# Altium project eTraceConcrete_V1_1.PrjPcb (part 4 of 7)

## Sheet AnalogInputs.SchDoc
size A3
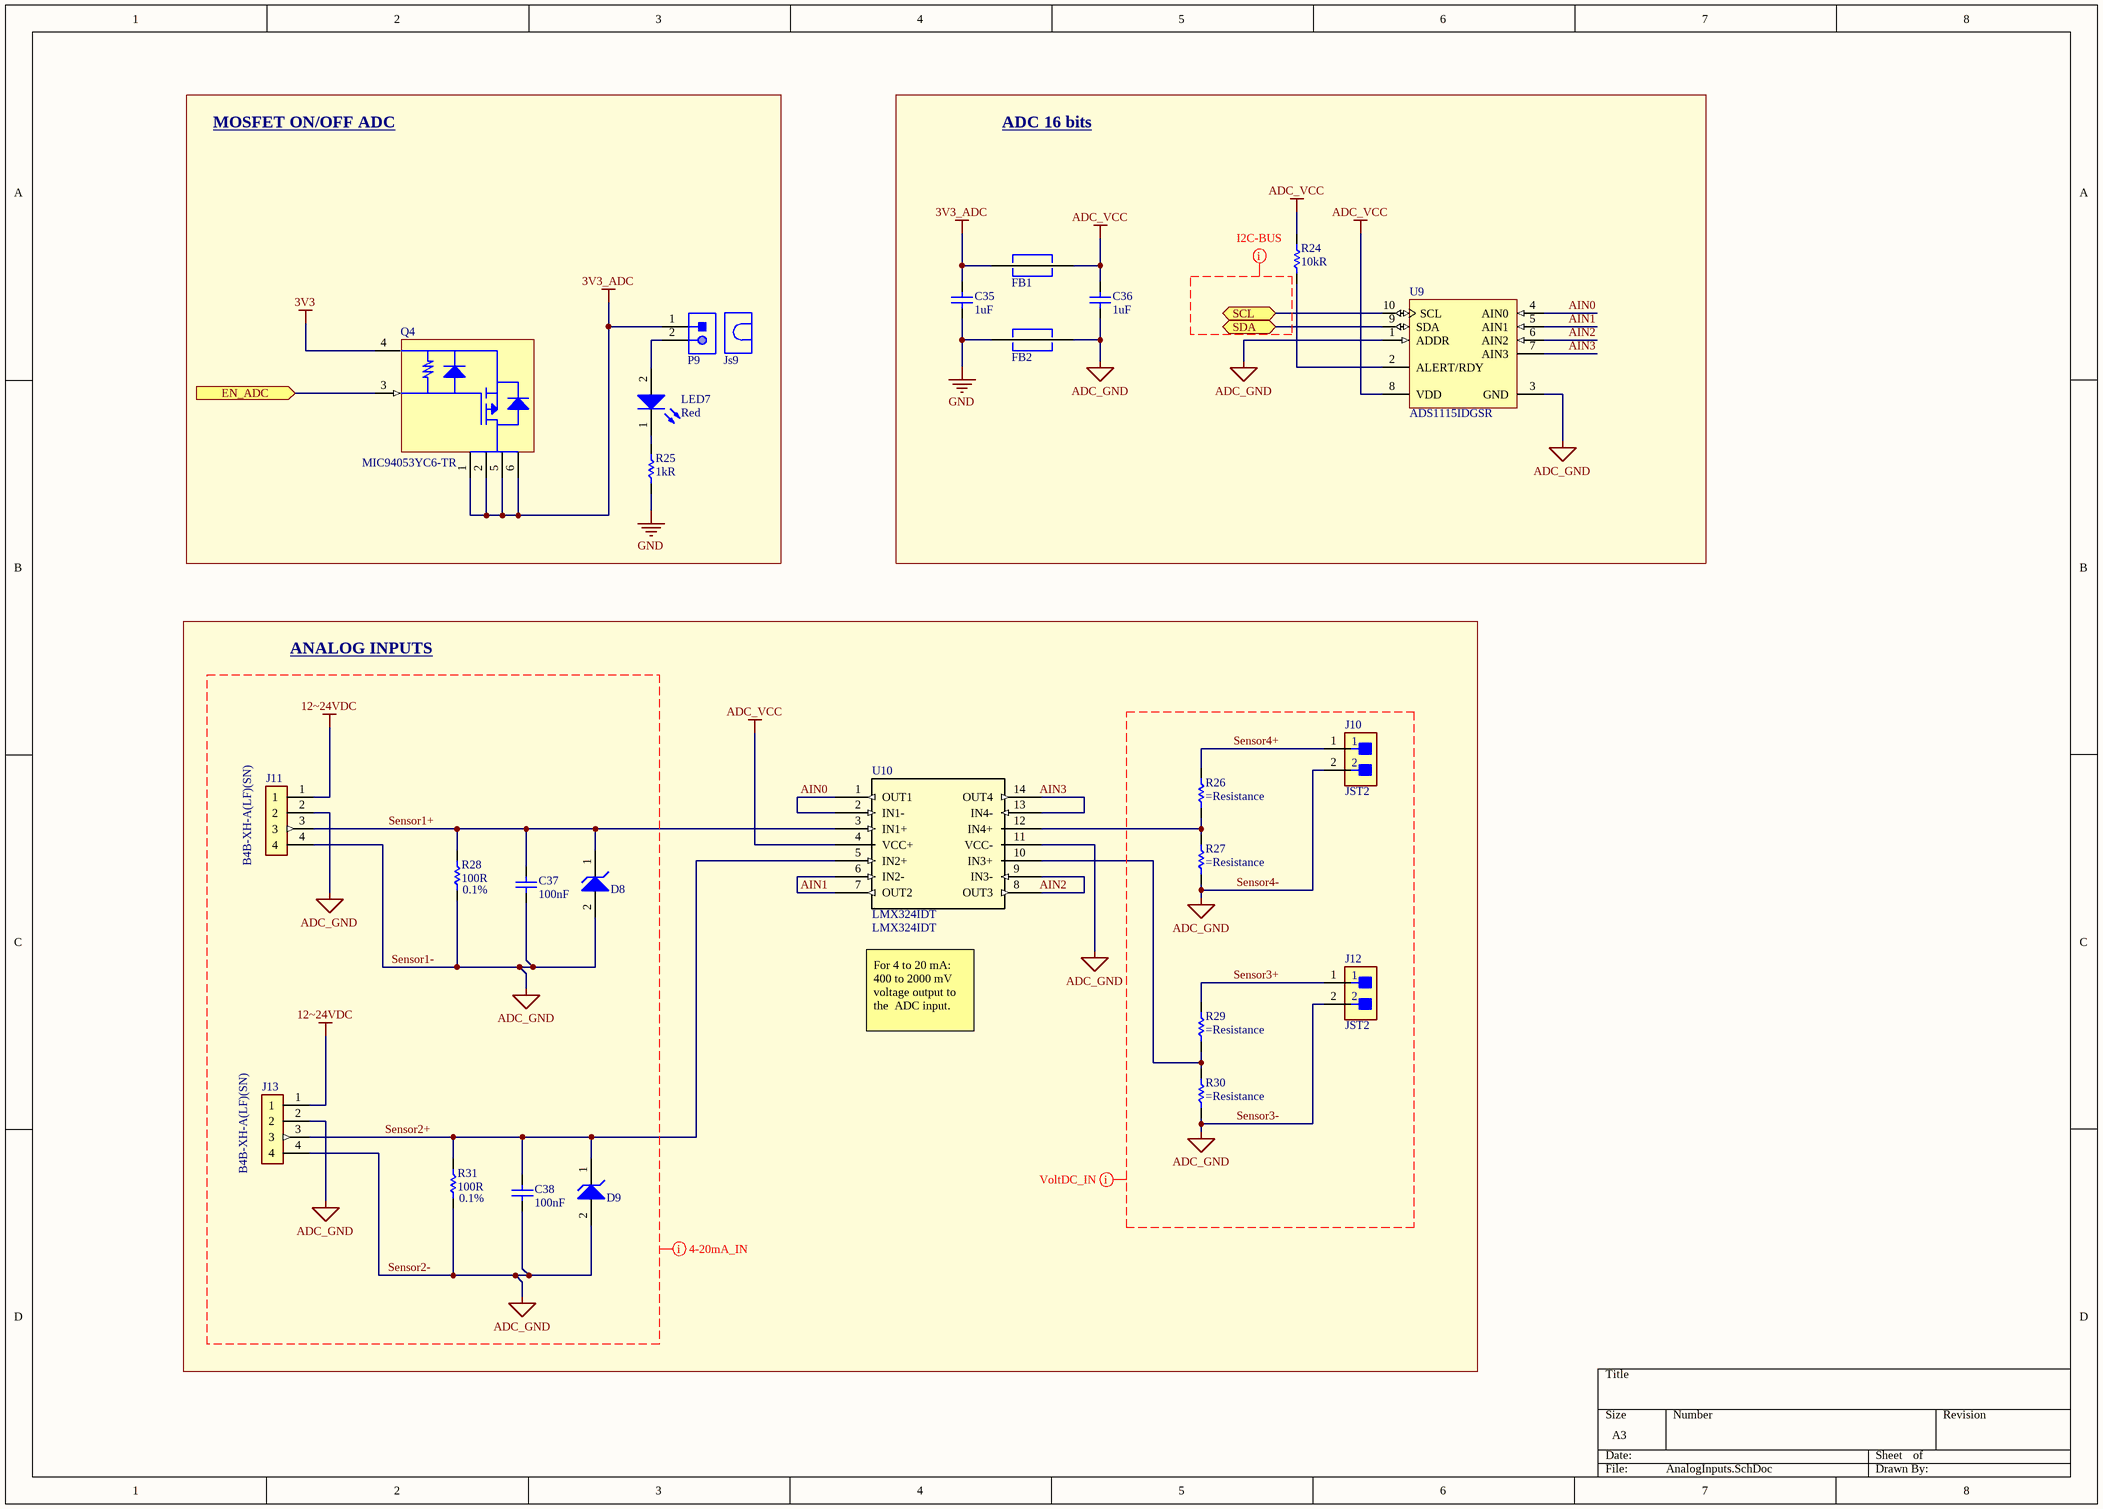
[diagram p4: AnalogInputs.SchDoc]

### Parts
C35  1uF  [Cap 0805 (2012 Metric)]
C36  1uF  [Cap 0805 (2012 Metric)]
C37  100nF  [Cap 0805 (2012 Metric)]
C38  100nF  [Cap 0805 (2012 Metric)]
D8  Diode  [Diode SOD123]  (value not drawn)
D9  Diode  [Diode SOD123]  (value not drawn)
FB1  Ferrite Bead  [Ferrite Bead 0805 (2012 Metric)]  (value not drawn)
FB2  Ferrite Bead  [Ferrite Bead 0805 (2012 Metric)]  (value not drawn)
J10  JST2  [JST2]
J11  B4B-XH-A(LF)(SN)  [B4B-XH-A(LF)(SN)]
J12  JST2  [JST2]
J13  B4B-XH-A(LF)(SN)  [B4B-XH-A(LF)(SN)]
Js9  Jumper (2x1)  [Header JMP 2x1]  (value not drawn)
LED7  Red  [LED 0805(2012 METRIC)]
P9  Header 2x1  [Header 2x1]  (value not drawn)
Q4  MIC94053YC6-TR  [SC-70-6]
R24  10kR  [Res 0805 (2012 Metric)]
R25  1kR  [Res 0805 (2012 Metric)]
R26  (no value)  [Res 0805 (2012 Metric)]
R27  (no value)  [Res 0805 (2012 Metric)]
R28  100R  Tolerance: 0.1%  [Res 1206 (3216 Metric)]
R29  (no value)  [Res 0805 (2012 Metric)]
R30  (no value)  [Res 0805 (2012 Metric)]
R31  100R  Tolerance: 0.1%  [Res 1206 (3216 Metric)]
U9  ADS1115IDGSR  [10-VSSOP]
U10  LMX324IDT  [LMX324IDT]

### Blocks framed on the sheet
MOSFET ON/OFF ADC: Js9 LED7 P9 Q4 R25
ADC 16 bits: C35 C36 FB1 FB2 R24 U9
ANALOG INPUTS: C37 C38 D8 D9 J10-J13 R26-R31 U10

### Ports
EN_ADC (in), SCL (bidir), SDA (bidir)

### Nets
3V3: Q4.4(S)
3V3_ADC: C35.1 FB1.1 P9.1 Q4.1(D) Q4.2(D) Q4.5(D) Q4.6(D)
12~24VDC: J11.1 J13.1
ADC_VCC: C36.1 FB1.2 R24.1 U9.8(VDD) U10.4(VCC+)
GND: C35.2 FB2.2 R25.2  [project net BS]
Sensor1-: C36.2 C37.2 C38.2 D8.2(A) D9.2(A) FB2.1 J10.2 J11.2 J11.4 J12.2 J13.2 J13.4 R27.2 R28.2 R30.2 R31.2 U9.1(ADDR) U9.3(GND) U10.11(VCC-)  [also labelled ADC_GND, Sensor2-, Sensor3-, Sensor4-]
AIN0: U9.4(AIN0) U10.1(OUT1) U10.2(IN1-)
AIN1: U9.5(AIN1) U10.6(IN2-) U10.7(OUT2)
AIN2: U9.6(AIN2) U10.8(OUT3) U10.9(IN3-)
AIN3: U9.7(AIN3) U10.13(IN4-) U10.14(OUT4)
EN_ADC: Q4.3(G) ; port EN_ADC
SCL: U9.10(SCL) ; port SCL
SDA: U9.9(SDA) ; port SDA
Sensor1+: C37.1 D8.1(K) J11.3 R28.1 U10.3(IN1+)
Sensor2+: C38.1 D9.1(K) J13.3 R31.1 U10.5(IN2+)
Sensor3+: J12.1 R29.1
Sensor4+: J10.1 R26.1
NetLED7_1: LED7.1(K) R25.1
NetLED7_2: LED7.2(A) P9.2
NetR24_2: R24.2 U9.2(ALERT/RDY)
NetR26_2: R26.2 R27.1 U10.12(IN4+)
NetR29_2: R29.2 R30.1 U10.10(IN3+)

### Layout directives
net class 4-20mA_IN: 12~24VDC, ADC_GND, Sensor1+, Sensor1-, Sensor2+, Sensor2-
net class VoltDC_IN: ADC_GND, Sensor3+, Sensor3-, Sensor4+, Sensor4-
net class I2C-BUS: (no net found under the mark)

### Notes on the sheet
- For 4 to 20 mA:
  400 to 2000 mV voltage output to the  ADC input.

### Library data of the parts
C35 C36 = Capacitor: Ceramic capacitor SMD-0805 1000nF /16V X7R# K +-10%, Samsung, RoHS/3000pcs/; Manufacturer Part Number: CL21B105KOFNNNG; Voltage Rating: 16V; Tolerance: 10%; Dielectric: X7R; Link: https://www.digikey.com/es/products/detail/samsung-electro-mechanics/CL21B105KOFNNNG/3894469?s=N4IgTCBcDaIMIBkwEYBCyAMBWA0geQDEA5EgcRAF0BfIA; Supplier 1: Digi-Key; Supplier Part Number 1: 1276-6471-1-ND; Manufacturer: Samsung; RoHS: Yes; Category: Ceramic Capacitors; Stock 1: 36000; Pricing 1: 1=0,10000, 10=0,05700, 50=0,03120, 100=0,02540, 500=0,01816, 1000=0,01426 (USD); Mount: Surface Mount; Case/Package: 0805; Case Code (Metric): 2012; Case Code (Imperial): 0805; Material: Ceramic; Min Operating Temperature: -55°C; Max Operating Temperature: 125°C; Package Quantity: 3000; Packaging: Tape and Reel; Capacitance: 1uF; Voltage: 16V; Series: CL; Length: 2mm; Width: 0.049inch; Height: 1.25mm; Thickness: 0.053inch; Depth: 1.25mm; Lead Free: Lead Free; ComponentLink1URL: https://datasheet.ciiva.com/25733/cl21b105kofnnng-25733281.pdf?src-supplier=Digi-Key; ComponentLink1Description: https://datasheet.ciiva.com/25733/cl21b105kofnnng-25733281.pdf?src-supplier=Digi-Key; ComponentLink2URL: https://datasheet.ciiva.com/29199/455935-da-01-en-vs-kondensator-0805-29199047.pdf?src-supplier=Conrad; ComponentLink2Description: https://datasheet.ciiva.com/29199/455935-da-01-en-vs-kondensator-0805-29199047.pdf?src-supplier=Conrad; ComponentLink3URL: https://datasheet.ciiva.com/16428/cl05b104kq5nnnc-16428885.pdf?src-supplier=Future+Electronics; ComponentLink3Description: https://datasheet.ciiva.com/16428/cl05b104kq5nnnc-16428885.pdf?src-supplier=Future+Electronics; ComponentLink4URL: https://datasheet.ciiva.com/26310/mlcc-catalogdownload2013-eng-26310156.pdf?src-supplier=Distrelec; ComponentLink4Description: https://datasheet.ciiva.com/26310/mlcc-catalogdownload2013-eng-26310156.pdf?src-supplier=Distrelec
C37 C38 = Capacitor: YAGEO (PHYCOMP)         CC0805ZRY5V9BB104             SMD Multilayer Ceramic Capacitor, 0805 [2012 Metric], 0.1 uF, 50 V, +80%, -20%, Y5V, CC Series; Tolerance: 80%; Voltage Rating: 50V; Link: https://www.digikey.com/es/products/detail/yageo/CC0805ZRY5V9BB104/2103099?s=N4IgTCBcDaIMJwAwA5EFYBaAlAmmgagJwBCxAjIgCwgC6AvkA; Supplier 1: Digi-Key; Supplier Part Number 1: 311-1361-1-ND; Manufacturer: Yageo; Manufacturer Part Number: CC0805ZRY5V9BB104; RoHS: Yes; Category: Ceramic Capacitors; Stock 1: 92689; Pricing 1: 1=0,10000, 10=0,07000, 50=0,03800, 100=0,03100, 500=0,02214, 1000=0,01739 (USD); Mount: Surface Mount; Case/Package: 0805; Number of Pins: 2; Case Code (Metric): 2012; Case Code (Imperial): 0805; Material: Ceramic; Dielectric Material: Ceramic; Min Operating Temperature: -30°C; Max Operating Temperature: 85°C; Capacitance: 100nF; Dielectric: Y5V; Package Quantity: 1; Packaging: Tape and Reel; Voltage Rating (DC): 50V; Termination: SMD/SMT; Resistor Type: Ceramic; Series: CC; Construction: Flat; Length: 2mm; Width: 0.049inch; Height: 0.6mm; Depth: 1.25mm; Thickness: 0.024inch; Radiation Hardening: No; REACH SVHC: No SVHC; Lead Free: Lead Free; Halogen Free: Halogen Free; RoHS Compliant: Yes; ComponentLink1URL: https://datasheet.ciiva.com/144/mlccorderingcode-144209.pdf?src-supplier=Digi-Key; ComponentLink1Description: https://datasheet.ciiva.com/144/mlccorderingcode-144209.pdf?src-supplier=Digi-Key; ComponentLink2URL: https://datasheet.ciiva.com/144/mlccorderingcode-144210.pdf?src-supplier=Digi-Key; ComponentLink2Description: https://datasheet.ciiva.com/144/mlccorderingcode-144210.pdf?src-supplier=Digi-Key; ComponentLink3URL: https://datasheet.ciiva.com/144/mlccorderingcode-144211.pdf?src-supplier=Digi-Key; ComponentLink3Description: https://datasheet.ciiva.com/144/mlccorderingcode-144211.pdf?src-supplier=Digi-Key; ComponentLink4URL: https://datasheet.ciiva.com/11465/upy-gphc-y5v-6-3v-to-50v-5-11465865.pdf?src-supplier=Avnet; ComponentLink4Description: https://datasheet.ciiva.com/11465/upy-gphc-y5v-6-3v-to-50v-5-11465865.pdf?src-supplier=Avnet; ComponentLink5URL: https://datasheet.ciiva.com/13389/upy-gp-np0-16v-to-50v-8-13389351.pdf?src-supplier=Mouser; ComponentLink5Description: https://datasheet.ciiva.com/13389/upy-gp-np0-16v-to-50v-8-13389351.pdf?src-supplier=Mouser; ComponentLink6URL: https://datasheet.ciiva.com/17435/upy-gphc-y5v-6-3v-to-50v-5-17435053.pdf?src-supplier=Avnet+Europe; ComponentLink6Description: https://datasheet.ciiva.com/17435/upy-gphc-y5v-6-3v-to-50v-5-17435053.pdf?src-supplier=Avnet+Europe; ComponentLink7URL: https://datasheet.ciiva.com/15189/getdatasheetpartid-55882-15189238.pdf?src-supplier=Verical; ComponentLink7Description: https://datasheet.ciiva.com/15189/getdatasheetpartid-55882-15189238.pdf?src-supplier=Verical; ComponentLink8URL: https://datasheet.ciiva.com/16747/upy-gphc-y5v-6-3v-to-50v-5-revised-16747323.pdf?src-supplier=Future+Electronics; ComponentLink8Description: https://datasheet.ciiva.com/16747/upy-gphc-y5v-6-3v-to-50v-5-revised-16747323.pdf?src-supplier=Future+Electronics; ComponentLink9URL: https://datasheet.ciiva.com/28450/1132289-28450870.pdf?src-supplier=Element14; ComponentLink9Description: https://datasheet.ciiva.com/28450/1132289-28450870.pdf?src-supplier=Element14; ComponentLink10URL: https://datasheet.ciiva.com/29241/445331-da-01-en-kerko-chip-0805-y5v0-1uf-20-80proz50vg-29241946.pdf?src-supplier=Conrad; ComponentLink10Description: https://datasheet.ciiva.com/29241/445331-da-01-en-kerko-chip-0805-y5v0-1uf-20-80proz50vg-29241946.pdf?src-supplier=Conrad
D8 D9 = Diode: DIODE GEN PURP 75V 150MA 0603; Manufacturer: Taiwan Semiconductor; Manufacturer Part Number: TS4148CRZG; Forward Voltage: 1.25V; Peak Non-Repetitive Surge Current: 800mA; Element Configuration: Single; Max Forward Surge Current (Ifsm): 2A; Reverse Recovery Time: 4ns; Link: https://www.digikey.com/es/products/detail/taiwan-semiconductor-corporation/TS4148C-RZG/7359811?s=N4IgTCBcDaICoGUAsBGJAOAwgJQFoHEQBdAXyA; Supplier 1: Digi-Key; Supplier Part Number 1: TS4148CRZGCT-ND; RoHS: Yes; Category: Uncategorized; Stock 1: 278970; Pricing 1: 1=0,39000, 10=0,29400, 100=0,16640, 500=0,11022, 1000=0,08450, 2000=0,07348 (USD); Mount: Surface Mount; Case/Package: SMD/SMT; Number of Pins: 2; Min Operating Temperature: -55°C; Max Operating Temperature: 150°C; Packaging: Tape and Reel; Package Quantity: 5000; Max Repetitive Reverse Voltage (Vrrm): 75V; Radiation Hardening: No; RoHS Compliant: Yes; ComponentLink1URL: https://datasheet.ciiva.com/18168/getdatasheetpartid-464901-18168310.pdf?src-supplier=Verical; ComponentLink1Description: https://datasheet.ciiva.com/18168/getdatasheetpartid-464901-18168310.pdf?src-supplier=Verical
FB1 FB2 = Ferrite Bead: 1 kOhms @ 100MHz 1 Power Line Ferrite Bead 0805 (2012 Metric) 1.5A 150mOhm; Manufacturer: TDK; Manufacturer Part Number: MPZ2012S102AT000; Tolerance: 25%; Impedance: 1kR; DC Resistance (DCR): 150mR; Link: https://www.digikey.com/product-detail/en/tdk-corporation/MPZ2012S102AT000/445-5223-1-ND/2117957; Supplier 1: Digi-Key; Supplier Part Number 1: 445-5223-1-ND; RoHS: Yes; Category: Inductors; Stock 1: 277470; Pricing 1: 1=0,11000, 10=0,09100, 25=0,07040, 50=0,05840, 100=0,05030, 250=0,04028, 500=0,03624, 1000=0,03020 (USD); Mount: Surface Mount; Case/Package: 0805; Weight: 0.000194oz; Case Code (Metric): 2012; Case Code (Imperial): 0805; Core Material: Ferrite; Min Operating Temperature: -55°C; Max Operating Temperature: 125°C; Termination: SMD/SMT; Test Frequency: 100MHz; Package Quantity: 4000; Packaging: Tape and Reel; Max DC Current: 1.5A; Current Rating: 1.5A; Length: 0.079inch; Height: 0.85mm; Width: 1.25mm; Depth: 1.25mm; REACH SVHC: No SVHC; ComponentLink1URL: https://datasheet.ciiva.com/46634/beads-commercial-power-mpz-en-46634422.pdf?src-supplier=Digi-Key; ComponentLink1Description: https://datasheet.ciiva.com/46634/beads-commercial-power-mpz-en-46634422.pdf?src-supplier=Digi-Key; ComponentLink2URL: https://datasheet.ciiva.com/46634/beads-commercial-power-mpz-en-46634424.pdf?src-supplier=Digi-Key; ComponentLink2Description: https://datasheet.ciiva.com/46634/beads-commercial-power-mpz-en-46634424.pdf?src-supplier=Digi-Key; ComponentLink3URL: https://datasheet.ciiva.com/48682/beads-commercial-power-mpz-en-48682506.pdf?src-supplier=Avnet; ComponentLink3Description: https://datasheet.ciiva.com/48682/beads-commercial-power-mpz-en-48682506.pdf?src-supplier=Avnet; ComponentLink4URL: https://datasheet.ciiva.com/46381/1856146-46381611.pdf?src-supplier=Element14; ComponentLink4Description: https://datasheet.ciiva.com/46381/1856146-46381611.pdf?src-supplier=Element14; ComponentLink5URL: https://datasheet.ciiva.com/46634/beads-commercial-power-mpz-en-46634366.pdf?src-supplier=Digi-Key; ComponentLink5Description: https://datasheet.ciiva.com/46634/beads-commercial-power-mpz-en-46634366.pdf?src-supplier=Digi-Key
J10 J12 = JST2: Conn Shrouded Header (4 Sides) HDR 2 POS 2.5mm Solder ST Thru-Hole Box; Manufacturer: JST; Manufacturer Part Number: B2B-XH-A(LF)(SN); Number of Positions: 2; Connector Type: Male Pin; Contact Resistance: 20mR; Max Current Rating: 3A; Max Voltage Rating (AC): 250V; Insulation Resistance: 1GR; Wire/Cable Gauge: 22AWG; Supplier 1: Farnell; RoHS: Yes; Category: FFC / FPC; Stock 1: 212689; Mount: Through Hole; Contact Plating: Tin,Copper,Lead; Color: Natural; Contact Material: Brass; Housing Material: Polyamide; Housing Color: White; Min Operating Temperature: -25°C; Max Operating Temperature: 85°C; Termination: Solder; Number of Rows: 1; Packaging: Bulk; Series: XH; Contact Type: Male Pin; Fastening Type: Detent; Orientation: Straight; Current Rating: 3A; Voltage Rating: 250V; Voltage Rating (AC): 250V; Number of Contacts: 2; Max Voltage Rating (DC): 250V; Length: 7.4mm; Pitch: 2.5mm; Depth: 5.75mm; Lead Pitch: 2.5mm; Lead Free: Lead Free; REACH SVHC: No SVHC; ComponentLink1URL: https://datasheet.ciiva.com/26894/getdatasheetpartid-640357-26894434.pdf?src-supplier=Verical; ComponentLink1Description: https://datasheet.ciiva.com/26894/getdatasheetpartid-640357-26894434.pdf?src-supplier=Verical; ComponentLink2URL: https://datasheet.ciiva.com/26894/getdatasheetpartid-385291-26894760.pdf?src-supplier=Verical; ComponentLink2Description: https://datasheet.ciiva.com/26894/getdatasheetpartid-385291-26894760.pdf?src-supplier=Verical; ComponentLink3URL: https://datasheet.ciiva.com/11746/0900766b8082653e-11746979.pdf?src-supplier=RSComponents; ComponentLink3Description: https://datasheet.ciiva.com/11746/0900766b8082653e-11746979.pdf?src-supplier=RSComponents; ComponentLink4URL: https://datasheet.ciiva.com/20207/523653-20207167.pdf?src-supplier=Rapid+Electronics; ComponentLink4Description: https://datasheet.ciiva.com/20207/523653-20207167.pdf?src-supplier=Rapid+Electronics; ComponentLink5URL: https://datasheet.ciiva.com/8052/5448-8052024.pdf?src-supplier=Element14; ComponentLink5Description: https://datasheet.ciiva.com/8052/5448-8052024.pdf?src-supplier=Element14; Supplier Part Number 1: 1516276; Pricing 1: 100=0,06860, 1000=0,04800, 2500=0,04520, 5000=0,04230, 10000=0,03950, 20000=0,03660 (GBP); Link: https://www.digikey.com/es/products/detail/jst-sales-america-inc/B2B-XH-A-LF-SN/1651045?s=N4IgTCBcDaIEJjgWgBoAkkEEAUAZAYgJTYDKAcoSALoC%2BQA
J11 J13 = B4B-XH-A(LF)(SN): JST (JAPAN SOLDERLESS TERMINALS) - B4B-XH-A (LF)(SN) - Wire-To-Board Connector, Vertical, 2.5 mm, 4 Contacts, Header, XH Series, Through Hole, 1 Rows; Insulation Resistance: 1GR; Current Rating: 3A; Contact Resistance: 20mR; Gender: Male; Number of Positions: 4; Max Voltage Rating (AC): 250V; Connector Type: Male Pin; Pitch: 2.5mm; Wire/Cable Gauge: 22AWG; Supplier 1: Arrow Electronics; Manufacturer: JST; RoHS: Yes; Category: FFC / FPC; Mount: Through Hole; Contact Plating: Tin,Copper,Lead; Contact Material: Brass; Color: Natural; Housing Material: Polyamide; Housing Color: White; Material: Polyamide; Min Operating Temperature: -25°C; Max Operating Temperature: 85°C; Termination: Press-Fit; Series: XH; Number of Rows: 1; Packaging: Bulk; Orientation: Straight; Max Current Rating: 3A; Package Quantity: 500; Number of Contacts: 4; Contact Type: Male Pin; Voltage Rating (AC): 250V; Voltage Rating: 250V; Max Voltage Rating (DC): 250V; Length: 12.4mm; Depth: 5.75mm; Lead Pitch: 2.5mm; REACH SVHC: No SVHC; Lead Free: Lead Free; ComponentLink1URL: https://datasheet.ciiva.com/26894/getdatasheetpartid-455616-26894787.pdf?src-supplier=Verical; ComponentLink1Description: https://datasheet.ciiva.com/26894/getdatasheetpartid-455616-26894787.pdf?src-supplier=Verical; ComponentLink2URL: https://datasheet.ciiva.com/16203/b4b-xh-alfsn-16203642.pdf?src-supplier=Future+Electronics; ComponentLink2Description: https://datasheet.ciiva.com/16203/b4b-xh-alfsn-16203642.pdf?src-supplier=Future+Electronics; ComponentLink3URL: https://datasheet.ciiva.com/26924/getdatasheetpartid-640571-26924035.pdf?src-supplier=Verical; ComponentLink3Description: https://datasheet.ciiva.com/26924/getdatasheetpartid-640571-26924035.pdf?src-supplier=Verical; ComponentLink4URL: https://datasheet.ciiva.com/726/exh-726404.pdf?src-supplier=Digi-Key; ComponentLink4Description: https://datasheet.ciiva.com/726/exh-726404.pdf?src-supplier=Digi-Key; Manufacturer Part Number: B4B-XH-A(LF)(SN); Supplier Part Number 1: B4B-XH-A (LF)(SN); Link: https://www.digikey.com/es/products/detail/jst-sales-america-inc/B4B-XH-A-LF-SN/1651047?s=N4IgTCBcDaIEIBY4FoAaAJZBBAFAGQDEBKHAZQDkiQBdAXyA
Js9 = Jumper (2x1): 2 (1 x 2) Position Shunt Connector Black Open Top 0.100" (2.54mm) Gold; Manufacturer: Sullins; Manufacturer Part Number: QPC02SXGN-RC; Number of Positions: 2; Pitch: 0.1inch; Link: https://www.digikey.com/product-detail/en/sullins-connector-solutions/QPC02SXGN-RC/S9337-ND/2618262; Supplier 1: Digi-Key; Supplier Part Number 1: S9337-ND; RoHS: Yes; Category: Connectors; Stock 1: 529611; Pricing 1: 1=0,10000, 10=0,05900, 25=0,04400, 50=0,03780, 100=0,03650, 250=0,03152, 500=0,03024, 1000=0,02646, 2500=0,02394 (USD); Case/Package: 100; Contact Plating: Gold; Package Quantity: 2000; Packaging: Bulk; Height: 0.235inch; Lead Free: Lead Free; ComponentLink1URL: https://datasheet.ciiva.com/767/284-sxgn-11510-767869.pdf?src-supplier=Digi-Key; ComponentLink1Description: https://datasheet.ciiva.com/767/284-sxgn-11510-767869.pdf?src-supplier=Digi-Key
LED7 = LED: SMD LED red 2.4 V 0805, 150080RS75000, Würth Elektronik; Manufacturer: Wurth Electronics; Luminous Intensity: 150mcd; Viewing Angle: 140°; Forward Voltage: 2V; Wavelength: 625nm; Lens Style: Clear,Rectangular; Forward Current: 30mA; Test Current: 20mA; Link: https://www.digikey.com/es/products/detail/w%C3%BCrth-elektronik/150080RS75000/4489918?s=N4IgTCBcDaIIwFYAMSAcSBKBlA7MlIAugL5A; Supplier 1: Digi-Key; Supplier Part Number 1: 732-4984-1-ND; Manufacturer Part Number: 150080RS75000; RoHS: Yes; Category: LEDs; Stock 1: 57843; Pricing 1: 1=0,18000, 50=0,16500, 100=0,14200, 500=0,12300 (USD); Mount: Surface Mount; Case/Package: 0805; Color: Red; Case Code (Metric): 2012; Case Code (Imperial): 0805; Min Operating Temperature: -40°C; Max Operating Temperature: 85°C; Package Quantity: 4000; Packaging: Tape and Reel; Dominant Wavelength: 625nm; Length: 2mm; Width: 1.25mm; Height: 0.7mm; REACH SVHC: Unknown; RoHS Compliant: Yes; ComponentLink1URL: https://datasheet.ciiva.com/22656/150080rs75000-22656961.pdf?src-supplier=Element14; ComponentLink1Description: https://datasheet.ciiva.com/22656/150080rs75000-22656961.pdf?src-supplier=Element14; ComponentLink2URL: https://datasheet.ciiva.com/29279/759435-da-01-en-chipled-0805-w-kl-rot-150080rs75000-29279032.pdf?src-supplier=Conrad; ComponentLink2Description: https://datasheet.ciiva.com/29279/759435-da-01-en-chipled-0805-w-kl-rot-150080rs75000-29279032.pdf?src-supplier=Conrad
P9 = Header 2x1: Connector Header Through Hole 2 position 0.100" (2.54mm); Manufacturer: Amphenol FCI; Manufacturer Part Number: 68001-402HLF; Number of Contacts: 2; Connector Type: Male Pin; Insulation Resistance: 5GR; Max Voltage Rating (AC): 1.5kV; Gender: Male; Current Rating: 3A; Contact Post Length: 3.05mm; Link: https://www.digikey.com/product-detail/en/amphenol-icc-fci/68001-402HLF/609-3507-ND/1530472; Supplier 1: Digi-Key; Supplier Part Number 1: 609-3507-ND; RoHS: Yes; Category: Headers and Wire Housings; Stock 1: 5598; Pricing 1: 1=0,12000, 10=0,11600, 100=0,07160, 500=0,05928, 1000=0,05187, 5000=0,04446, 10000=0,04323 (USD); Mount: Through Hole; Contact Plating: Tin; Housing Material: Thermoplastic; Housing Color: Black; Color: Black; Contact Material: Bronze; Min Operating Temperature: -65°C; Max Operating Temperature: 125°C; Termination: Solder; Number of Rows: 1; Number of Positions: 2; Orientation: Straight; Package Quantity: 100; Packaging: Bulk; Contact Gender: Male; Voltage Rating: 1.5kV; Length: 5.08mm; Pitch: 2.54mm; Contact Mating Length: 0.23inch; Depth: 2.41mm; Radiation Hardening: No; REACH SVHC: No SVHC; Flammability Rating: UL94 V-0; Lead Free: Lead Free; ComponentLink1URL: https://datasheet.ciiva.com/724/68000-724389.pdf?src-supplier=Digi-Key; ComponentLink1Description: https://datasheet.ciiva.com/724/68000-724389.pdf?src-supplier=Digi-Key; ComponentLink2URL: https://datasheet.ciiva.com/16726/68000-16726185.pdf?src-supplier=Avnet+Europe; ComponentLink2Description: https://datasheet.ciiva.com/16726/68000-16726185.pdf?src-supplier=Avnet+Europe; ComponentLink3URL: https://datasheet.ciiva.com/10149/68000-10149338.pdf?src-supplier=Avnet; ComponentLink3Description: https://datasheet.ciiva.com/10149/68000-10149338.pdf?src-supplier=Avnet; ComponentLink4URL: https://datasheet.ciiva.com/46385/1748756-46385306.pdf?src-supplier=Element14; ComponentLink4Description: https://datasheet.ciiva.com/46385/1748756-46385306.pdf?src-supplier=Element14
Q4 = TransistorMosfet(Load): P-Channel 6V 2A (Ta) 270mW (Ta) Surface Mount SC-70-6; Manufacturer: Microchip; Link: https://www.digikey.com/product-detail/en/microchip-technology/MIC94053YC6-TR/576-2939-1-ND/1822099; Supplier 1: Digi-Key; Supplier Part Number 1: 576-2939-1-ND; Manufacturer Part Number: MIC94053YC6-TR; RoHS: Yes; Category: MOSFETs; Stock 1: 3005; Pricing 1: 1=0,58000, 25=0,48000, 100=0,46250 (USD); ComponentLink1URL: https://datasheet.ciiva.com/6379/mic94052-53-6379193.pdf?src-supplier=Digi-Key; ComponentLink1Description: https://datasheet.ciiva.com/6379/mic94052-53-6379193.pdf?src-supplier=Digi-Key; ComponentLink2URL: https://datasheet.ciiva.com/6379/mic94052-53-6379189.pdf?src-supplier=Digi-Key; ComponentLink2Description: https://datasheet.ciiva.com/6379/mic94052-53-6379189.pdf?src-supplier=Digi-Key; ComponentLink3URL: https://datasheet.ciiva.com/46408/264781-46408581.pdf?src-supplier=Element14; ComponentLink3Description: https://datasheet.ciiva.com/46408/264781-46408581.pdf?src-supplier=Element14; ComponentLink4URL: https://datasheet.ciiva.com/15200/getdatasheetpartid-111629-15200795.pdf?src-supplier=Verical; ComponentLink4Description: https://datasheet.ciiva.com/15200/getdatasheetpartid-111629-15200795.pdf?src-supplier=Verical
R24 = Resistor: RES 10K OHM 1% 1/4W 0805; Manufacturer: Stackpole Electronics; Manufacturer Part Number: RNCP0805FTD10K0; Max Power Dissipation: 250mW; Temperature Coefficient: 100ppm/°C; Link: https://www.digikey.com/en/products/detail/stackpole-electronics-inc/RNCP0805FTD10K0/2240262; Supplier 1: Digi-Key; Supplier Part Number 1: RNCP0805FTD10K0CT-ND; RoHS: Yes; Category: Chip SMD Resistors; Stock 1: 271706; Pricing 1: 1=0,10000, 10=0,07300, 100=0,02970, 1000=0,01336, 2500=0,01159 (USD); Mount: Surface Mount; Case/Package: 0805; Case Code (Metric): 2012; Case Code (Imperial): 0805; Min Operating Temperature: -55°C; Max Operating Temperature: 155°C; Resistance: 10kR; Tolerance: 1%; Packaging: Tape and Reel; Resistor Type: Thin Film; Number of Terminations: 2; Features: Moisture Resistant,Anti-Sulfur; Series: RNCP; Length: 0.079inch; Width: 0.049inch; Height: 0.024inch; Lead Free: Lead Free; RoHS Compliant: Yes; ComponentLink1URL: https://www.seielect.com/catalog/SEI-Packaging.pdf?src-supplier=Digi-Key; ComponentLink1Description: https://www.seielect.com/catalog/SEI-Packaging.pdf?src-supplier=Digi-Key
R25 = Resistor: RES 1K OHM 1% 1/4W 0805; Manufacturer: Stackpole Electronics; Manufacturer Part Number: RNCP0805FTD1K00; Power Rating: 250mW; Temperature Coefficient: 100ppm/°C; Link: https://www.digikey.com/es/products/detail/stackpole-electronics-inc/RNCP0805FTD1K00/2240229?s=N4IgTCBcDaIEoDkDCAFADADjQVgGIBUARARgGk00QBdAXyA; Supplier 1: Digi-Key; Supplier Part Number 1: RNCP0805FTD1K00CT-ND; RoHS: Yes; Category: Chip SMD Resistors; Stock 1: 316834; Pricing 1: 1=0,10000, 10=0,07000, 100=0,02830, 1000=0,01272, 2500=0,01104 (USD); Mount: Surface Mount; Case/Package: 0805; Case Code (Metric): 2012; Case Code (Imperial): 0805; Size Code: 0805; Min Operating Temperature: -55°C; Max Operating Temperature: 155°C; Tolerance: 1%; Resistance: 1kR; Packaging: Tape and Reel; Resistor Type: Thin Film; Number of Terminations: 2; Max Power Dissipation: 250mW; Features: Moisture Resistant,Anti-Sulfur; Series: RNCP; Length: 0.079inch; Width: 0.049inch; Height: 0.024inch; Lead Free: Lead Free; RoHS Compliant: Yes; ComponentLink1URL: https://www.seielect.com/catalog/SEI-Packaging.pdf?src-supplier=Digi-Key; ComponentLink1Description: https://www.seielect.com/catalog/SEI-Packaging.pdf?src-supplier=Digi-Key; ComponentLink2URL: https://www.seielect.com/Catalog/SEI-rncp.pdf?src-supplier=Digi-Key; ComponentLink2Description: https://www.seielect.com/Catalog/SEI-rncp.pdf?src-supplier=Digi-Key; ComponentLink3URL: http://www.seielect.com/Catalog/SEI-rncp.pdf?src-supplier=Future+Electronics; ComponentLink3Description: http://www.seielect.com/Catalog/SEI-rncp.pdf?src-supplier=Future+Electronics
R26 R27 R29 R30 = Resistor
R28 R31 = Resistor: RES 100 OHM 0.40W 0.1% 1206; Manufacturer: Vishay Dale Thin Film; Manufacturer Part Number: PTN1206E1000BST1; Max Power Dissipation: 400mW; Temperature Coefficient: 25ppm/°C; Operating Supply Voltage: 200V; Link: https://www.digikey.com/es/products/detail/vishay-dale-thin-film/PTN1206E1000BST1/2281890; Supplier 1: Digi-Key; Supplier Part Number 1: 764-1205-1-ND; RoHS: Yes; Category: Chip SMD Resistors; Stock 1: 3315; Pricing 1: 1=0,80000, 10=0,69300, 100=0,48300 (USD); Case/Package: 1206; Case Code (Metric): 3216; Case Code (Imperial): 1206; Contact Plating: Copper,Tin,Silver; Min Operating Temperature: -55°C; Max Operating Temperature: 155°C; Packaging: Tape and Reel; Resistance: 100R; Resistor Type: Thin Film; Number of Terminations: 2; Features: Moisture Resistant,Anti-Sulfur; Series: PTN; Length: 0.126inch; Width: 0.063inch; Height: 0.033inch; Radiation Hardening: No; Lead Free: Lead Free; RoHS Compliant: Yes; ComponentLink1URL: https://datasheet.ciiva.com/8981/ptn-8981095.pdf?src-supplier=Avnet; ComponentLink1Description: https://datasheet.ciiva.com/8981/ptn-8981095.pdf?src-supplier=Avnet
U9 = ADS1115IDGSR: TEXAS INSTRUMENTS - ADS1115IDGSR - ADC, 16BIT, 860SPS, I2C, VSSOP-10; Number of Inputs: 4; Max Supply Voltage (DC): 5.5V; Min Supply Voltage (DC): 2V; Integral Nonlinearity (INL): 1LSB; Supply Type: Single; Conversion Rate: 0.86KS/s; Number of Bits: 16; Sampling Rate: 860S/s; Number of A/D Converters: 1; Resolution: 16b; Polarity: Bipolar; Power Dissipation: 900uW; Link: https://www.digikey.com/product-detail/en/texas-instruments/ADS1115IDGSR/296-38849-1-ND/5142969; Supplier 1: Digi-Key; Supplier Part Number 1: 296-38849-1-ND; Manufacturer: Texas Instruments; Manufacturer Part Number: ADS1115IDGSR; RoHS: Yes; Category: Analog to Digital Converters (ADCs); Stock 1: 18300; Pricing 1: 1=5,36000, 10=4,81700, 25=4,55400, 100=3,74440, 250=3,35984, 500=3,23840, 1000=2,69192 (USD); Case/Package: VSSOP; Number of Pins: 10; Contact Plating: Gold; Min Operating Temperature: -40°C; Max Operating Temperature: 125°C; Interface: I2C; Number of Converters: 1; Min Supply Voltage: 2V; Max Supply Voltage: 5.5V; Package Quantity: 2500; Packaging: Tape and Reel; Radiation Hardening: No; Lead Free: Lead Free; REACH SVHC: No SVHC; ComponentLink1URL: https://datasheet.ciiva.com/4031/47725463s8438921n7713-4031028.pdf?src-supplier=Arrow; ComponentLink1Description: https://datasheet.ciiva.com/4031/47725463s8438921n7713-4031028.pdf?src-supplier=Arrow; ComponentLink2URL: https://datasheet.ciiva.com/25993/sbas444b-25993205.pdf?src-supplier=Avnet+Europe; ComponentLink2Description: https://datasheet.ciiva.com/25993/sbas444b-25993205.pdf?src-supplier=Avnet+Europe; ComponentLink3URL: https://datasheet.ciiva.com/1304/ads1113-1304266.pdf?src-supplier=Digi-Key; ComponentLink3Description: https://datasheet.ciiva.com/1304/ads1113-1304266.pdf?src-supplier=Digi-Key
U10 = LMX324IDT: OP Amp Quad GP R-R O/P 5.5V 14-Pin SOIC T/R; Manufacturer: STMicroelectronics; Common Mode Rejection Ratio: 72dB; Min Supply Voltage: 2.3V; Voltage Gain: 110dB; Gain Bandwidth Product: 1.3MHz; Slew Rate: 0.7V/µs; Number of Channels: 4; Output Current: 26mA; Nominal Supply Current: 180uA; Input Bias Current: 27nA; Input Offset Voltage (Vos): 4mV; Operating Supply Current: 130uA; Output Current per Channel: 70mA; Amplifier Type: GENERAL PURPOSE; Supplier 1: Digi-Key; RoHS: Yes; Category: Amplifiers - Op Amps, Buffer, Instrumentation; Stock 1: 1878; Mount: Surface Mount; Case/Package: SOIC; Number of Pins: 14; Min Operating Temperature: -40°C; Max Operating Temperature: 125°C; Max Supply Voltage: 5.5V; Unity Gain Bandwidth Product: 1.3MHz; Packaging: Tape and Reel; Package Quantity: 2500; Number of Circuits: 4; Number of Elements: 4; Series: -; Supply Current: 180uA; Input Offset Voltage-Max: 4mV; Slew Rate-Nom: 0.7V/µs; Radiation Hardening: No; Lead Free: Lead Free; ComponentLink1URL: https://datasheet.ciiva.com/16219/dm00050849-16219587.pdf?src-supplier=Future+Electronics; ComponentLink1Description: https://datasheet.ciiva.com/16219/dm00050849-16219587.pdf?src-supplier=Future+Electronics; ComponentLink2URL: https://datasheet.ciiva.com/2966/dm00050849-2966046.pdf?src-supplier=Avnet; ComponentLink2Description: https://datasheet.ciiva.com/2966/dm00050849-2966046.pdf?src-supplier=Avnet; Pricing 1: 1=1,26000, 10=1,12900, 25=1,07160, 100=0,88010, 250=0,82272, 500=0,72706, 1000=0,63175 (USD); Supplier Part Number 1: 497-13021-1-ND; Link: https://www.digikey.com/en/products/detail/LMX324IDT/497-13021-1-ND/3306194?itemSeq=375639467; Manufacturer Part Number: LMX324IDT

## Sheet thermocouple.SchDoc
size A3
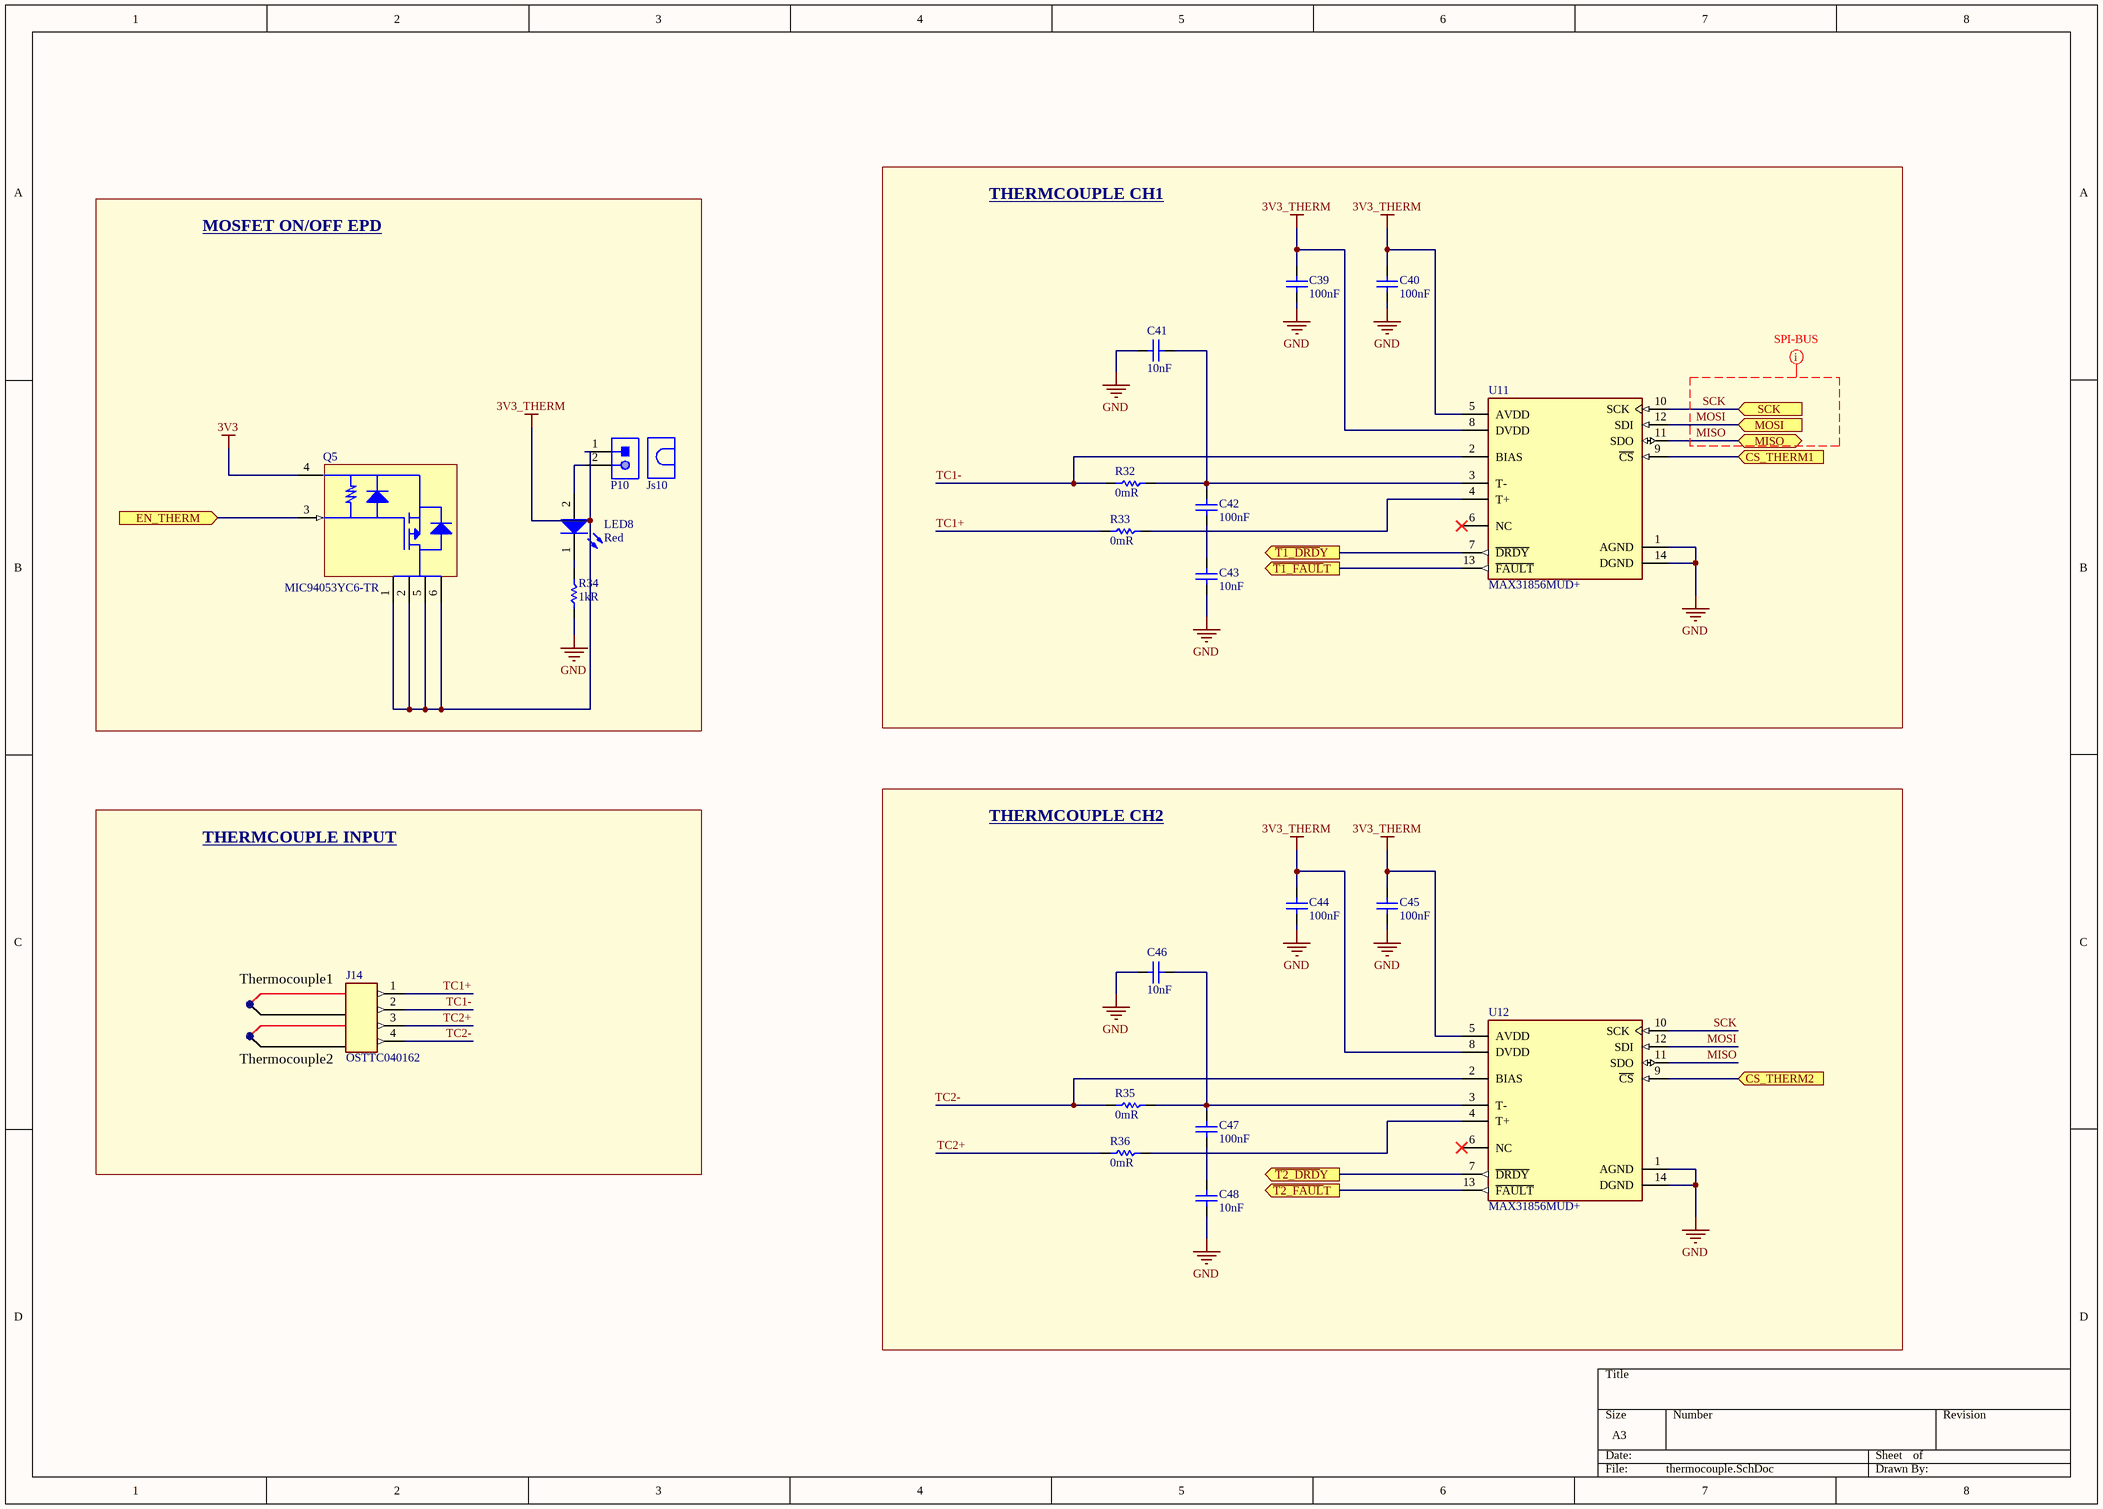
[diagram p5: thermocouple.SchDoc]

### Parts
C39  100nF  [Cap 0805 (2012 Metric)]
C40  100nF  [Cap 0805 (2012 Metric)]
C41  10nF  [Cap 0603 (1608 Metric)]
C42  100nF  [Cap 0805 (2012 Metric)]
C43  10nF  [Cap 0603 (1608 Metric)]
C44  100nF  [Cap 0805 (2012 Metric)]
C45  100nF  [Cap 0805 (2012 Metric)]
C46  10nF  [Cap 0603 (1608 Metric)]
C47  100nF  [Cap 0805 (2012 Metric)]
C48  10nF  [Cap 0603 (1608 Metric)]
J14  OSTTC040162  [OSTTC040162]
Js10  Jumper (2x1)  [Header JMP 2x1]  (value not drawn)
LED8  Red  [LED 0805(2012 METRIC)]
P10  Header 2x1  [Header 2x1]  (value not drawn)
Q5  MIC94053YC6-TR  [SC-70-6]
R32  0mR  [Res 0805 (2012 Metric)]
R33  0mR  [Res 0805 (2012 Metric)]
R34  1kR  [Res 0805 (2012 Metric)]
R35  0mR  [Res 0805 (2012 Metric)]
R36  0mR  [Res 0805 (2012 Metric)]
U11  MAX31856MUD+  [MAX31856MUD+]
U12  MAX31856MUD+  [MAX31856MUD+]

### Blocks framed on the sheet
THERMCOUPLE CH1: C39-C43 R32 R33 U11
MOSFET ON/OFF EPD: Js10 LED8 P10 Q5 R34
THERMCOUPLE INPUT: J14
THERMCOUPLE CH2: C44-C48 R35 R36 U12

### Ports
CS_THERM1 (in), CS_THERM2 (in), EN_THERM (in), MISO (bidir), MOSI (in), SCK (in), ~{T1_DRD}Y (out), ~{T1_FAUL}T (out), ~{T2_DRD}Y (out), ~{T2_FAUL}T (out)

### Nets
3V3: Q5.4(S)
3V3_THERM: C39.1 C40.1 C44.1 C45.1 P10.1 Q5.1(D) Q5.2(D) Q5.5(D) Q5.6(D) U11.5(AVDD) U11.8(DVDD) U12.5(AVDD) U12.8(DVDD)
GND: C39.2 C40.2 C41.1 C43.1 C44.2 C45.2 C46.1 C48.1 R34.2 U11.1(AGND) U11.14(DGND) U12.1(AGND) U12.14(DGND)  [project net BS]
~{T1_DRD}Y: U11.7(~{DRDY}) ; port ~{T1_DRD}Y
~{T1_FAUL}T: U11.13(~{FAULT}) ; port ~{T1_FAUL}T
~{T2_DRD}Y: U12.7(~{DRDY}) ; port ~{T2_DRD}Y
~{T2_FAUL}T: U12.13(~{FAULT}) ; port ~{T2_FAUL}T
CS_THERM1: U11.9(~{CS}) ; port CS_THERM1
CS_THERM2: U12.9(~{CS}) ; port CS_THERM2
EN_THERM: Q5.3(G) ; port EN_THERM
MISO: U11.11(SDO) U12.11(SDO) ; port MISO
MOSI: U11.12(SDI) U12.12(SDI) ; port MOSI
SCK: U11.10(SCK) U12.10(SCK) ; port SCK
TC1+: J14.1 R33.1
TC1-: J14.2 R32.1 U11.2(BIAS)
TC2+: J14.3 R36.1
TC2-: J14.4 R35.1 U12.2(BIAS)
NetC41_2: C41.2 C42.1 R32.2 U11.3(T-)
NetC42_2: C42.2 C43.2
NetC46_2: C46.2 C47.1 R35.2 U12.3(T-)
NetC47_2: C47.2 C48.2
NetLED8_1: LED8.1(K) R34.1
NetLED8_2: LED8.2(A) P10.2
NetR33_2: R33.2 U11.4(T+)
NetR36_2: R36.2 U12.4(T+)

Not connected (* = marked no-connect by the designer): U11 6(NC)*; U12 6(NC)*

### Layout directives
net class SPI-BUS: MISO, MOSI, SCK

### Notes on the sheet
- (near J14) Thermocouple1
- (near J14) Thermocouple2

### Library data of the parts
C39 C40 C42 C44 C45 C47 = Capacitor: as C37 on sheet AnalogInputs; Link: https://www.digikey.com/es/products/detail/yageo/CC0805ZRY5V9BB104/2103099?s=N4IgTCBcDaIMJwAwA5EFYBaAlAmmgagJwBCxAjIgCwgC6AvkA; Supplier 1: Digi-Key; Supplier Part Number 1: 311-1361-1-ND; Manufacturer: Yageo; Manufacturer Part Number: CC0805ZRY5V9BB104; RoHS: Yes; Category: Ceramic Capacitors; Stock 1: 92689; Pricing 1: 1=0,10000, 10=0,07000, 50=0,03800, 100=0,03100, 500=0,02214, 1000=0,01739 (USD); Mount: Surface Mount; Case/Package: 0805; Number of Pins: 2; Case Code (Metric): 2012; Case Code (Imperial): 0805; Material: Ceramic; Dielectric Material: Ceramic; Min Operating Temperature: -30°C; Max Operating Temperature: 85°C; Capacitance: 100nF; Dielectric: Y5V; Package Quantity: 1; Packaging: Tape and Reel; Voltage Rating (DC): 50V; Termination: SMD/SMT; Resistor Type: Ceramic; Series: CC; Construction: Flat; Length: 2mm; Width: 0.049inch; Height: 0.6mm; Depth: 1.25mm; Thickness: 0.024inch; Radiation Hardening: No; REACH SVHC: No SVHC; Lead Free: Lead Free; Halogen Free: Halogen Free; RoHS Compliant: Yes; ComponentLink1URL: https://datasheet.ciiva.com/144/mlccorderingcode-144209.pdf?src-supplier=Digi-Key; ComponentLink1Description: https://datasheet.ciiva.com/144/mlccorderingcode-144209.pdf?src-supplier=Digi-Key; ComponentLink2URL: https://datasheet.ciiva.com/144/mlccorderingcode-144210.pdf?src-supplier=Digi-Key; ComponentLink2Description: https://datasheet.ciiva.com/144/mlccorderingcode-144210.pdf?src-supplier=Digi-Key; ComponentLink3URL: https://datasheet.ciiva.com/144/mlccorderingcode-144211.pdf?src-supplier=Digi-Key; ComponentLink3Description: https://datasheet.ciiva.com/144/mlccorderingcode-144211.pdf?src-supplier=Digi-Key; ComponentLink4URL: https://datasheet.ciiva.com/11465/upy-gphc-y5v-6-3v-to-50v-5-11465865.pdf?src-supplier=Avnet; ComponentLink4Description: https://datasheet.ciiva.com/11465/upy-gphc-y5v-6-3v-to-50v-5-11465865.pdf?src-supplier=Avnet; ComponentLink5URL: https://datasheet.ciiva.com/13389/upy-gp-np0-16v-to-50v-8-13389351.pdf?src-supplier=Mouser; ComponentLink5Description: https://datasheet.ciiva.com/13389/upy-gp-np0-16v-to-50v-8-13389351.pdf?src-supplier=Mouser; ComponentLink6URL: https://datasheet.ciiva.com/17435/upy-gphc-y5v-6-3v-to-50v-5-17435053.pdf?src-supplier=Avnet+Europe; ComponentLink6Description: https://datasheet.ciiva.com/17435/upy-gphc-y5v-6-3v-to-50v-5-17435053.pdf?src-supplier=Avnet+Europe; ComponentLink7URL: https://datasheet.ciiva.com/15189/getdatasheetpartid-55882-15189238.pdf?src-supplier=Verical; ComponentLink7Description: https://datasheet.ciiva.com/15189/getdatasheetpartid-55882-15189238.pdf?src-supplier=Verical; ComponentLink8URL: https://datasheet.ciiva.com/16747/upy-gphc-y5v-6-3v-to-50v-5-revised-16747323.pdf?src-supplier=Future+Electronics; ComponentLink8Description: https://datasheet.ciiva.com/16747/upy-gphc-y5v-6-3v-to-50v-5-revised-16747323.pdf?src-supplier=Future+Electronics; ComponentLink9URL: https://datasheet.ciiva.com/28450/1132289-28450870.pdf?src-supplier=Element14; ComponentLink9Description: https://datasheet.ciiva.com/28450/1132289-28450870.pdf?src-supplier=Element14; ComponentLink10URL: https://datasheet.ciiva.com/29241/445331-da-01-en-kerko-chip-0805-y5v0-1uf-20-80proz50vg-29241946.pdf?src-supplier=Conrad; ComponentLink10Description: https://datasheet.ciiva.com/29241/445331-da-01-en-kerko-chip-0805-y5v0-1uf-20-80proz50vg-29241946.pdf?src-supplier=Conrad
C41 C43 C46 C48 = Capacitor: Cap Ceramic 0.01uF 50V X7R 10% SMD 0603 125C Automotive T/R; Manufacturer: Yageo; Manufacturer Part Number: CC0603KRX7R9BB103; Insulation Resistance: 100GR; Link: https://www.digikey.com/es/products/detail/yageo/CC0603KRX7R9BB103/302819?s=N4IgTCBcDaIMJwAwDZEGYDSAlAGgdiwE4AhYgRnRAF0BfIA; Supplier 1: Digi-Key; Supplier Part Number 1: 311-1085-1-ND; RoHS: Yes; Category: Ceramic Capacitors; Stock 1: 1726445; Pricing 1: 1=0,10000, 10=0,03700, 50=0,02000, 100=0,01630, 500=0,01168, 1000=0,00917 (USD); Mount: Surface Mount; Case/Package: 0603; Number of Pins: 2; Case Code (Metric): 1608; Case Code (Imperial): 0603; Material: Ceramic; Min Operating Temperature: -55°C; Max Operating Temperature: 125°C; Tolerance: 10%; Packaging: Tape and Reel; Capacitance: 10nF; Dielectric: X7R; Voltage Rating: 50V; Voltage Rating (DC): 50V; Package Quantity: 1; Termination: SMD/SMT; Voltage: 50V; Series: CC; Resistor Type: Ceramic; Length: 1.6mm; Width: 0.031inch; Height: 0.8mm; Depth: 0.8mm; Thickness: 0.035inch; Radiation Hardening: No; RoHS Compliant: Yes; Lead Free: Lead Free; REACH SVHC: No SVHC; Halogen Free: Halogen Free; ComponentLink1URL: https://datasheet.ciiva.com/11788/0900766b8079c870-11788374.pdf?src-supplier=RSComponents; ComponentLink1Description: https://datasheet.ciiva.com/11788/0900766b8079c870-11788374.pdf?src-supplier=RSComponents; ComponentLink2URL: https://datasheet.ciiva.com/26862/getdatasheetpartid-403582-26862846.pdf?src-supplier=Verical; ComponentLink2Description: https://datasheet.ciiva.com/26862/getdatasheetpartid-403582-26862846.pdf?src-supplier=Verical; ComponentLink3URL: https://datasheet.ciiva.com/176/mlccorderingcode-176550.pdf?src-supplier=Digi-Key; ComponentLink3Description: https://datasheet.ciiva.com/176/mlccorderingcode-176550.pdf?src-supplier=Digi-Key; ComponentLink4URL: https://datasheet.ciiva.com/176/mlccorderingcode-176551.pdf?src-supplier=Digi-Key; ComponentLink4Description: https://datasheet.ciiva.com/176/mlccorderingcode-176551.pdf?src-supplier=Digi-Key; ComponentLink5URL: https://datasheet.ciiva.com/176/mlccorderingcode-176552.pdf?src-supplier=Digi-Key; ComponentLink5Description: https://datasheet.ciiva.com/176/mlccorderingcode-176552.pdf?src-supplier=Digi-Key; ComponentLink6URL: https://datasheet.ciiva.com/13389/upy-gphc-x7r-6-3v-to-50v-8-13389991.pdf?src-supplier=Mouser; ComponentLink6Description: https://datasheet.ciiva.com/13389/upy-gphc-x7r-6-3v-to-50v-8-13389991.pdf?src-supplier=Mouser; ComponentLink7URL: https://datasheet.ciiva.com/16625/upy-gphc-x7r-6-3v-to-50v-8-16625529.pdf?src-supplier=Avnet+Europe; ComponentLink7Description: https://datasheet.ciiva.com/16625/upy-gphc-x7r-6-3v-to-50v-8-16625529.pdf?src-supplier=Avnet+Europe; ComponentLink8URL: https://datasheet.ciiva.com/28450/1489800-28450619.pdf?src-supplier=Element14; ComponentLink8Description: https://datasheet.ciiva.com/28450/1489800-28450619.pdf?src-supplier=Element14; ComponentLink9URL: https://datasheet.ciiva.com/8033/1734573-8033816.pdf?src-supplier=Element14; ComponentLink9Description: https://datasheet.ciiva.com/8033/1734573-8033816.pdf?src-supplier=Element14; ComponentLink10URL: https://datasheet.ciiva.com/8033/70765-8033817.pdf?src-supplier=Element14; ComponentLink10Description: https://datasheet.ciiva.com/8033/70765-8033817.pdf?src-supplier=Element14; ComponentLink11URL: https://datasheet.ciiva.com/8033/1734573-8033861.pdf?src-supplier=Element14; ComponentLink11Description: https://datasheet.ciiva.com/8033/1734573-8033861.pdf?src-supplier=Element14
J14 = OSTTC040162: Conn Terminal Block 4 POS 5mm Solder ST Thru-Hole 15A; Manufacturer: On-Shore Technology; Plating: Steel; Number of Levels: 1; Number of Positions Per Level: 4; Voltage: 300V; Wire Gauge (Max): 22AWG; Wire Gauge (Min): 14AWG; Pitch: 0.197inch; Supplier 1: Digi-Key; RoHS: Yes; Category: Terminal Blocks; Stock 1: 6766; Mount: Through Hole; Number of Pins: 4; Color: Blue; Contact Plating: Tin; Housing Color: Blue; Contact Material: Brass; Housing Material: Thermoplastic; Min Operating Temperature: -30°C; Max Operating Temperature: 105°C; Packaging: Bulk; Current: 15A; Termination: Screw; Number of Positions: 4; Number of Rows: 1; Series: OSTTC; Length: 20mm; Width: 7.6mm; Height: 10mm; Flammability Rating: UL94 V-0; RoHS Compliant: Yes; ComponentLink1URL: https://datasheet.ciiva.com/825/osttcxx0162-825113.pdf?src-supplier=Digi-Key; ComponentLink1Description: https://datasheet.ciiva.com/825/osttcxx0162-825113.pdf?src-supplier=Digi-Key; Link: https://www.digikey.com/en/products/detail/on-shore-technology-inc/OSTTC040162/614551; Supplier Part Number 1: ED2602-ND; Manufacturer Part Number: OSTTC040162; Pricing 1: 1=1,29000, 10=0,80600, 25=0,68960, 50=0,62000, 100=0,60700, 250=0,51660, 500=0,49076, 1000=0,43911, 5000=0,34440 (USD)
Js10 = Jumper (2x1): as Js9 on sheet AnalogInputs; Link: https://www.digikey.com/product-detail/en/sullins-connector-solutions/QPC02SXGN-RC/S9337-ND/2618262; Supplier 1: Digi-Key; Supplier Part Number 1: S9337-ND; RoHS: Yes; Category: Connectors; Stock 1: 529611; Pricing 1: 1=0,10000, 10=0,05900, 25=0,04400, 50=0,03780, 100=0,03650, 250=0,03152, 500=0,03024, 1000=0,02646, 2500=0,02394 (USD); Case/Package: 100; Contact Plating: Gold; Package Quantity: 2000; Packaging: Bulk; Height: 0.235inch; Lead Free: Lead Free; ComponentLink1URL: https://datasheet.ciiva.com/767/284-sxgn-11510-767869.pdf?src-supplier=Digi-Key; ComponentLink1Description: https://datasheet.ciiva.com/767/284-sxgn-11510-767869.pdf?src-supplier=Digi-Key
LED8 = LED: as LED7 on sheet AnalogInputs; Link: https://www.digikey.com/es/products/detail/w%C3%BCrth-elektronik/150080RS75000/4489918?s=N4IgTCBcDaIIwFYAMSAcSBKBlA7MlIAugL5A; Supplier 1: Digi-Key; Supplier Part Number 1: 732-4984-1-ND; Manufacturer Part Number: 150080RS75000; RoHS: Yes; Category: LEDs; Stock 1: 57843; Pricing 1: 1=0,18000, 50=0,16500, 100=0,14200, 500=0,12300 (USD); Mount: Surface Mount; Case/Package: 0805; Color: Red; Case Code (Metric): 2012; Case Code (Imperial): 0805; Min Operating Temperature: -40°C; Max Operating Temperature: 85°C; Package Quantity: 4000; Packaging: Tape and Reel; Dominant Wavelength: 625nm; Length: 2mm; Width: 1.25mm; Height: 0.7mm; REACH SVHC: Unknown; RoHS Compliant: Yes; ComponentLink1URL: https://datasheet.ciiva.com/22656/150080rs75000-22656961.pdf?src-supplier=Element14; ComponentLink1Description: https://datasheet.ciiva.com/22656/150080rs75000-22656961.pdf?src-supplier=Element14; ComponentLink2URL: https://datasheet.ciiva.com/29279/759435-da-01-en-chipled-0805-w-kl-rot-150080rs75000-29279032.pdf?src-supplier=Conrad; ComponentLink2Description: https://datasheet.ciiva.com/29279/759435-da-01-en-chipled-0805-w-kl-rot-150080rs75000-29279032.pdf?src-supplier=Conrad
P10 = Header 2x1: as P9 on sheet AnalogInputs; Link: https://www.digikey.com/product-detail/en/amphenol-icc-fci/68001-402HLF/609-3507-ND/1530472; Supplier 1: Digi-Key; Supplier Part Number 1: 609-3507-ND; RoHS: Yes; Category: Headers and Wire Housings; Stock 1: 5598; Pricing 1: 1=0,12000, 10=0,11600, 100=0,07160, 500=0,05928, 1000=0,05187, 5000=0,04446, 10000=0,04323 (USD); Mount: Through Hole; Contact Plating: Tin; Housing Material: Thermoplastic; Housing Color: Black; Color: Black; Contact Material: Bronze; Min Operating Temperature: -65°C; Max Operating Temperature: 125°C; Termination: Solder; Number of Rows: 1; Number of Positions: 2; Orientation: Straight; Package Quantity: 100; Packaging: Bulk; Contact Gender: Male; Voltage Rating: 1.5kV; Length: 5.08mm; Pitch: 2.54mm; Contact Mating Length: 0.23inch; Depth: 2.41mm; Radiation Hardening: No; REACH SVHC: No SVHC; Flammability Rating: UL94 V-0; Lead Free: Lead Free; ComponentLink1URL: https://datasheet.ciiva.com/724/68000-724389.pdf?src-supplier=Digi-Key; ComponentLink1Description: https://datasheet.ciiva.com/724/68000-724389.pdf?src-supplier=Digi-Key; ComponentLink2URL: https://datasheet.ciiva.com/16726/68000-16726185.pdf?src-supplier=Avnet+Europe; ComponentLink2Description: https://datasheet.ciiva.com/16726/68000-16726185.pdf?src-supplier=Avnet+Europe; ComponentLink3URL: https://datasheet.ciiva.com/10149/68000-10149338.pdf?src-supplier=Avnet; ComponentLink3Description: https://datasheet.ciiva.com/10149/68000-10149338.pdf?src-supplier=Avnet; ComponentLink4URL: https://datasheet.ciiva.com/46385/1748756-46385306.pdf?src-supplier=Element14; ComponentLink4Description: https://datasheet.ciiva.com/46385/1748756-46385306.pdf?src-supplier=Element14
Q5 = TransistorMosfet(Load): as Q4 on sheet AnalogInputs; Link: https://www.digikey.com/product-detail/en/microchip-technology/MIC94053YC6-TR/576-2939-1-ND/1822099; Supplier 1: Digi-Key; Supplier Part Number 1: 576-2939-1-ND; Manufacturer Part Number: MIC94053YC6-TR; RoHS: Yes; Category: MOSFETs; Stock 1: 3005; Pricing 1: 1=0,58000, 25=0,48000, 100=0,46250 (USD); ComponentLink1URL: https://datasheet.ciiva.com/6379/mic94052-53-6379193.pdf?src-supplier=Digi-Key; ComponentLink1Description: https://datasheet.ciiva.com/6379/mic94052-53-6379193.pdf?src-supplier=Digi-Key; ComponentLink2URL: https://datasheet.ciiva.com/6379/mic94052-53-6379189.pdf?src-supplier=Digi-Key; ComponentLink2Description: https://datasheet.ciiva.com/6379/mic94052-53-6379189.pdf?src-supplier=Digi-Key; ComponentLink3URL: https://datasheet.ciiva.com/46408/264781-46408581.pdf?src-supplier=Element14; ComponentLink3Description: https://datasheet.ciiva.com/46408/264781-46408581.pdf?src-supplier=Element14; ComponentLink4URL: https://datasheet.ciiva.com/15200/getdatasheetpartid-111629-15200795.pdf?src-supplier=Verical; ComponentLink4Description: https://datasheet.ciiva.com/15200/getdatasheetpartid-111629-15200795.pdf?src-supplier=Verical
R32 R33 R35 R36 = Resistor: CR Series 0805 0 O Jumper Surface Mount Thick Film Chip Resistor; Manufacturer: Viking Tech; Manufacturer Part Number: CR-05JL7----0R; Power Rating: 125mW; Tolerance: 5%; Link: https://www.digikey.com/es/products/detail/viking-tech/CR-05JL7-0R/12141914; Supplier 1: Future Electronics; Supplier Part Number 1: 9059663; RoHS: Yes; Category: Chip SMD Resistors; Pricing 1: 5000=0,00480, 20000=0,00400, 50000=0,00400, 125000=0,00390, 200000=0,00390 (USD); Mount: Surface Mount; Case/Package: 0805; Min Operating Temperature: -55°C; Max Operating Temperature: 155°C; Resistance: 0mR; Termination: Solder; Length: 2mm; Height: 0.5mm; Depth: 1.25mm; Lead Free: Lead Free; RoHS Compliant: Yes
R34 = Resistor: as R25 on sheet AnalogInputs; Link: https://www.digikey.com/es/products/detail/stackpole-electronics-inc/RNCP0805FTD1K00/2240229?s=N4IgTCBcDaIEoDkDCAFADADjQVgGIBUARARgGk00QBdAXyA; Supplier 1: Digi-Key; Supplier Part Number 1: RNCP0805FTD1K00CT-ND; RoHS: Yes; Category: Chip SMD Resistors; Stock 1: 316834; Pricing 1: 1=0,10000, 10=0,07000, 100=0,02830, 1000=0,01272, 2500=0,01104 (USD); Mount: Surface Mount; Case/Package: 0805; Case Code (Metric): 2012; Case Code (Imperial): 0805; Size Code: 0805; Min Operating Temperature: -55°C; Max Operating Temperature: 155°C; Tolerance: 1%; Resistance: 1kR; Packaging: Tape and Reel; Resistor Type: Thin Film; Number of Terminations: 2; Max Power Dissipation: 250mW; Features: Moisture Resistant,Anti-Sulfur; Series: RNCP; Length: 0.079inch; Width: 0.049inch; Height: 0.024inch; Lead Free: Lead Free; RoHS Compliant: Yes; ComponentLink1URL: https://www.seielect.com/catalog/SEI-Packaging.pdf?src-supplier=Digi-Key; ComponentLink1Description: https://www.seielect.com/catalog/SEI-Packaging.pdf?src-supplier=Digi-Key; ComponentLink2URL: https://www.seielect.com/Catalog/SEI-rncp.pdf?src-supplier=Digi-Key; ComponentLink2Description: https://www.seielect.com/Catalog/SEI-rncp.pdf?src-supplier=Digi-Key; ComponentLink3URL: http://www.seielect.com/Catalog/SEI-rncp.pdf?src-supplier=Future+Electronics; ComponentLink3Description: http://www.seielect.com/Catalog/SEI-rncp.pdf?src-supplier=Future+Electronics
U11 U12 = MAX31856MUD+: Precision Thermocouple to Digital Converter 14-Pin TSSOP Tube; Manufacturer: Maxim; Interface: SPI; Operating Supply Current: 1.2mA; Min Supply Voltage: 3V; Max Supply Voltage: 3.6V; Supplier 1: RSComponents; RoHS: Yes; Category: Temperature and Humidity Sensors; Stock 1: 1344; Mount: Surface Mount; Case/Package: TSSOP; Number of Pins: 14; Min Operating Temperature: -55°C; Max Operating Temperature: 125°C; Packaging: Rail/Tube; Output Type: Digital; RoHS Compliant: Yes; REACH SVHC: Unknown; ComponentLink1URL: http://www.farnell.com/datasheets/2025711.pdf?src-supplier=Farnell; ComponentLink1Description: http://www.farnell.com/datasheets/2025711.pdf?src-supplier=Farnell; ComponentLink2URL: https://media.digikey.com/pdf/Data%20Sheets/Maxim%20PDFs/PartNumberBreakdown_ds.pdf?src-supplier=Digi-Key; ComponentLink2Description: https://media.digikey.com/pdf/Data%20Sheets/Maxim%20PDFs/PartNumberBreakdown_ds.pdf?src-supplier=Digi-Key; ComponentLink3URL: http://datasheets.maximintegrated.com/en/ds/MAX31856.pdf?src-supplier=Avnet; ComponentLink3Description: http://datasheets.maximintegrated.com/en/ds/MAX31856.pdf?src-supplier=Avnet; ComponentLink4URL: http://www.farnell.com/datasheets/2025711.pdf?src-supplier=Newark; ComponentLink4Description: http://www.farnell.com/datasheets/2025711.pdf?src-supplier=Newark; ComponentLink5URL: http://www.farnell.com/datasheets/2002032.pdf?src-supplier=Element14; ComponentLink5Description: http://www.farnell.com/datasheets/2002032.pdf?src-supplier=Element14; Link: https://www.digikey.com/en/products/detail/MAX31856MUD%2b/MAX31856MUD%2b-ND/5050138?itemSeq=376683530; Supplier Part Number 1: 1904800; Manufacturer Part Number: MAX31856MUD+; Pricing 1: 96=4,87600, 192=4,03700, 288=3,94500 (GBP)